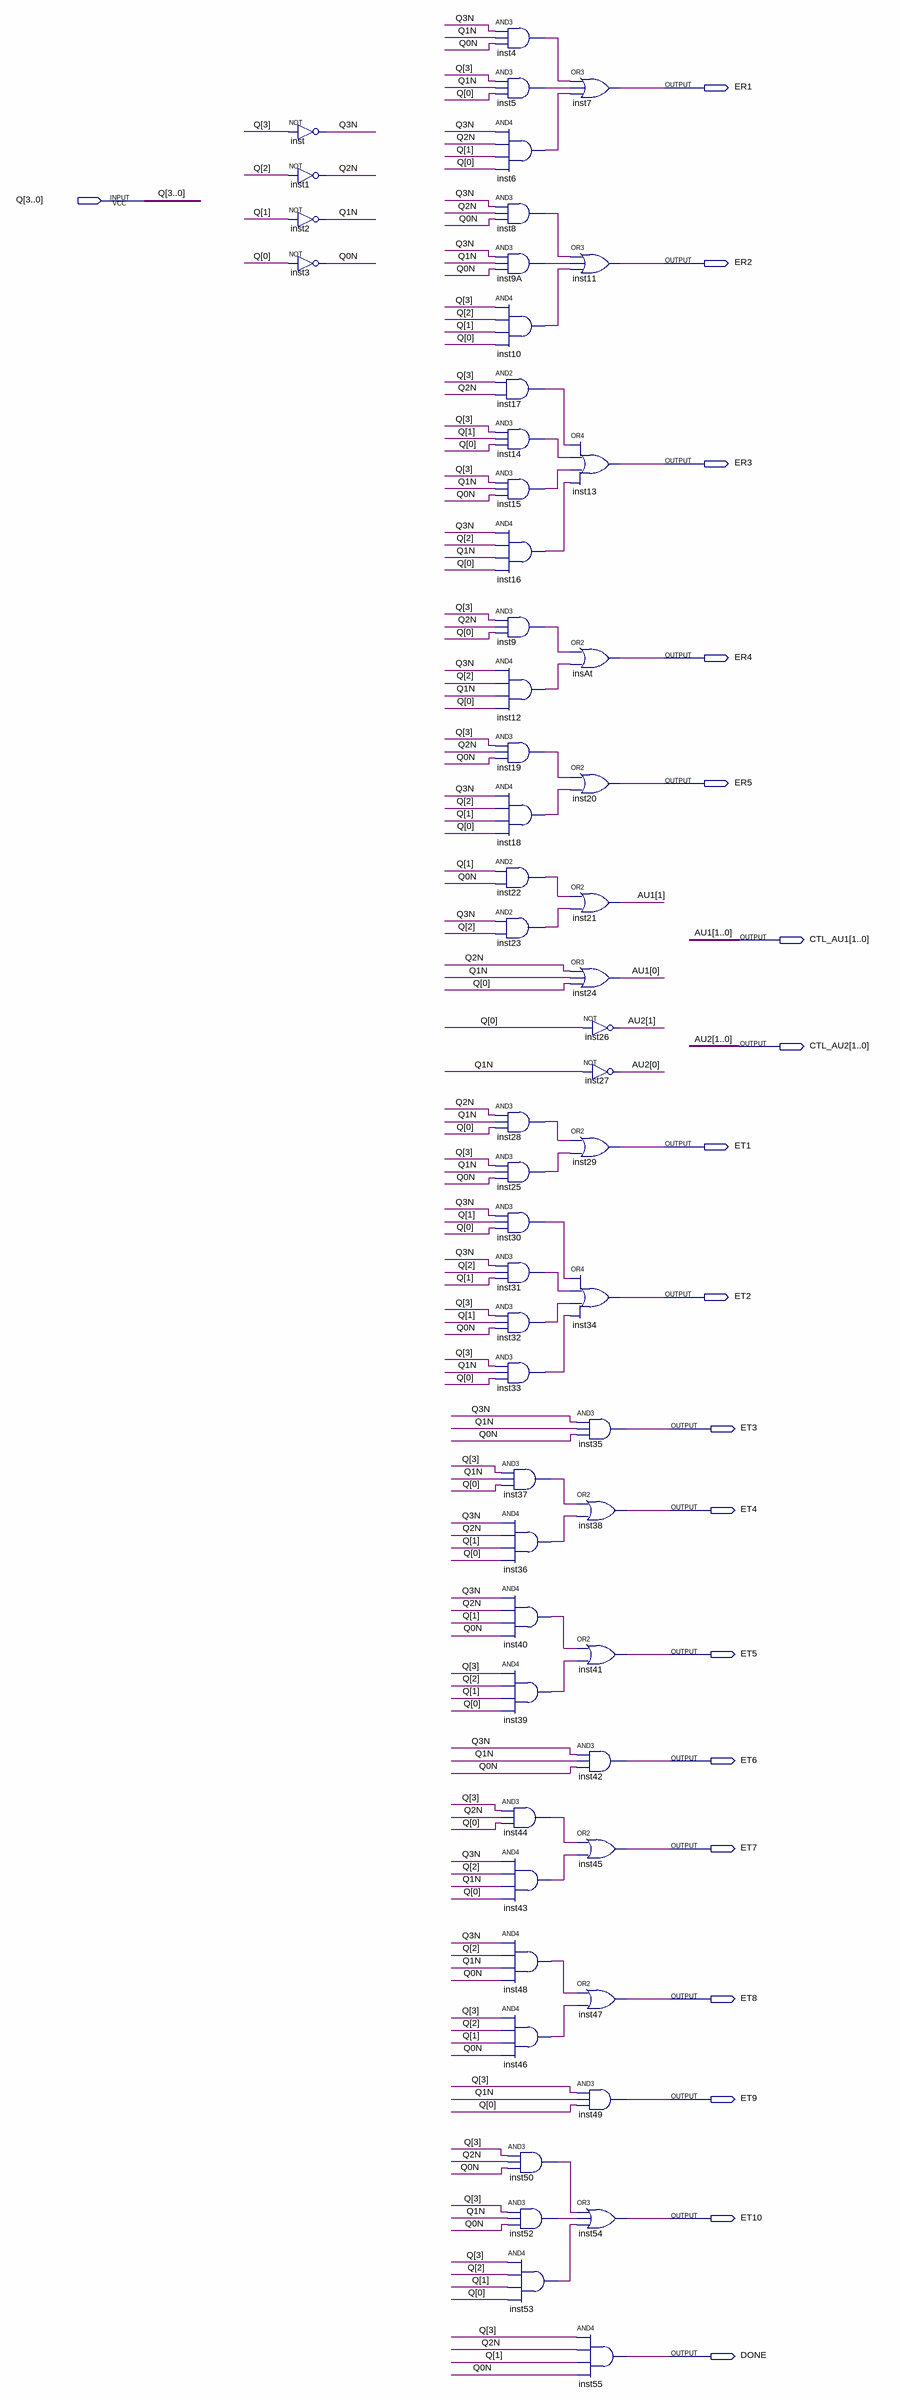
[diagram p0: schematic sheet]
// Quartus schematic OUTPUT.bdf as structural Verilog: 57 symbols, 19 pins
module OUTPUT (
  input  [3:0] Q,
  output ER1,
  output ER2,
  output ER3,
  output ER4,
  output ER5,
  output [1:0] CTL_AU1,
  output [1:0] CTL_AU2,
  output ET1,
  output ET2,
  output ET3,
  output ET4,
  output ET5,
  output ET6,
  output ET7,
  output ET8,
  output ET9,
  output ET10,
  output DONE
);

  wire inst4_out, inst5_out, inst6_out, inst8_out, inst9_out, inst9A_out, inst10_out, inst12_out, inst14_out,
       inst15_out, inst16_out, inst17_out, inst18_out, inst19_out, inst22_out, inst23_out, inst25_out,
       inst28_out, inst30_out, inst31_out, inst32_out, inst33_out, inst36_out, inst37_out, inst39_out,
       inst40_out, inst43_out, inst44_out, inst46_out, inst48_out, inst50_out, inst52_out, inst53_out, Q0N,
       Q1N, Q2N, Q3N;

  not inst (Q3N, Q[3]);
  not inst1 (Q2N, Q[2]);
  not inst2 (Q1N, Q[1]);
  not inst3 (Q0N, Q[0]);
  and inst4 (inst4_out, Q3N, Q1N, Q0N);
  and inst5 (inst5_out, Q[3], Q1N, Q[0]);
  and inst6 (inst6_out, Q3N, Q2N, Q[1], Q[0]);
  and inst8 (inst8_out, Q3N, Q2N, Q0N);
  and inst9A (inst9A_out, Q3N, Q1N, Q0N);
  and inst10 (inst10_out, Q[3], Q[2], Q[1], Q[0]);
  and inst17 (inst17_out, Q[3], Q2N);
  and inst14 (inst14_out, Q[3], Q[1], Q[0]);
  and inst15 (inst15_out, Q[3], Q1N, Q0N);
  and inst16 (inst16_out, Q3N, Q[2], Q1N, Q[0]);
  and inst9 (inst9_out, Q[3], Q2N, Q[0]);
  and inst12 (inst12_out, Q3N, Q[2], Q1N, Q[0]);
  and inst19 (inst19_out, Q[3], Q2N, Q0N);
  and inst18 (inst18_out, Q3N, Q[2], Q[1], Q[0]);
  and inst22 (inst22_out, Q[1], Q0N);
  and inst23 (inst23_out, Q3N, Q[2]);
  and inst28 (inst28_out, Q2N, Q1N, Q[0]);
  and inst25 (inst25_out, Q[3], Q1N, Q0N);
  and inst30 (inst30_out, Q3N, Q[1], Q[0]);
  and inst31 (inst31_out, Q3N, Q[2], Q[1]);
  and inst32 (inst32_out, Q[3], Q[1], Q0N);
  and inst33 (inst33_out, Q[3], Q1N, Q[0]);
  and inst37 (inst37_out, Q[3], Q1N, Q[0]);
  and inst36 (inst36_out, Q3N, Q2N, Q[1], Q[0]);
  and inst40 (inst40_out, Q3N, Q2N, Q[1], Q0N);
  and inst39 (inst39_out, Q[3], Q[2], Q[1], Q[0]);
  and inst44 (inst44_out, Q[3], Q2N, Q[0]);
  and inst43 (inst43_out, Q3N, Q[2], Q1N, Q[0]);
  and inst48 (inst48_out, Q3N, Q[2], Q1N, Q0N);
  and inst46 (inst46_out, Q[3], Q[2], Q[1], Q0N);
  and inst50 (inst50_out, Q[3], Q2N, Q0N);
  and inst52 (inst52_out, Q[3], Q1N, Q0N);
  and inst53 (inst53_out, Q[3], Q[2], Q[1], Q[0]);
  or inst7 (ER1, inst4_out, inst5_out, inst6_out);
  or inst11 (ER2, inst8_out, inst9A_out, inst10_out);
  or inst13 (ER3, inst17_out, inst14_out, inst15_out, inst16_out);
  or insAt (ER4, inst9_out, inst12_out);
  or inst20 (ER5, inst19_out, inst18_out);
  or inst21 (CTL_AU1[1], inst22_out, inst23_out);
  or inst24 (CTL_AU1[0], Q2N, Q1N, Q[0]);
  or inst29 (ET1, inst28_out, inst25_out);
  or inst34 (ET2, inst30_out, inst31_out, inst32_out, inst33_out);
  and inst35 (ET3, Q3N, Q1N, Q0N);
  or inst38 (ET4, inst37_out, inst36_out);
  or inst41 (ET5, inst40_out, inst39_out);
  and inst42 (ET6, Q3N, Q1N, Q0N);
  or inst45 (ET7, inst44_out, inst43_out);
  or inst47 (ET8, inst48_out, inst46_out);
  and inst49 (ET9, Q[3], Q1N, Q[0]);
  or inst54 (ET10, inst50_out, inst52_out, inst53_out);
  and inst55 (DONE, Q[3], Q2N, Q[1], Q0N);
  not inst26 (CTL_AU2[1], Q[0]);
  not inst27 (CTL_AU2[0], Q1N);

  // Other names for the same wires on the sheet: AU1[1:0] = CTL_AU1; AU2[1:0] = CTL_AU2
endmodule
